# Altium schematic sheet LPDDR4 SDRAM-1.SchDoc
size A3; Date: 07.08.2025; CheckedBy: Own Check; CompanyName: No Company; DocumentNumber: ELK.PCB.0005.0005.A.A; Revision: V0.0.1; SheetNumber: 4; SheetTotal: 22
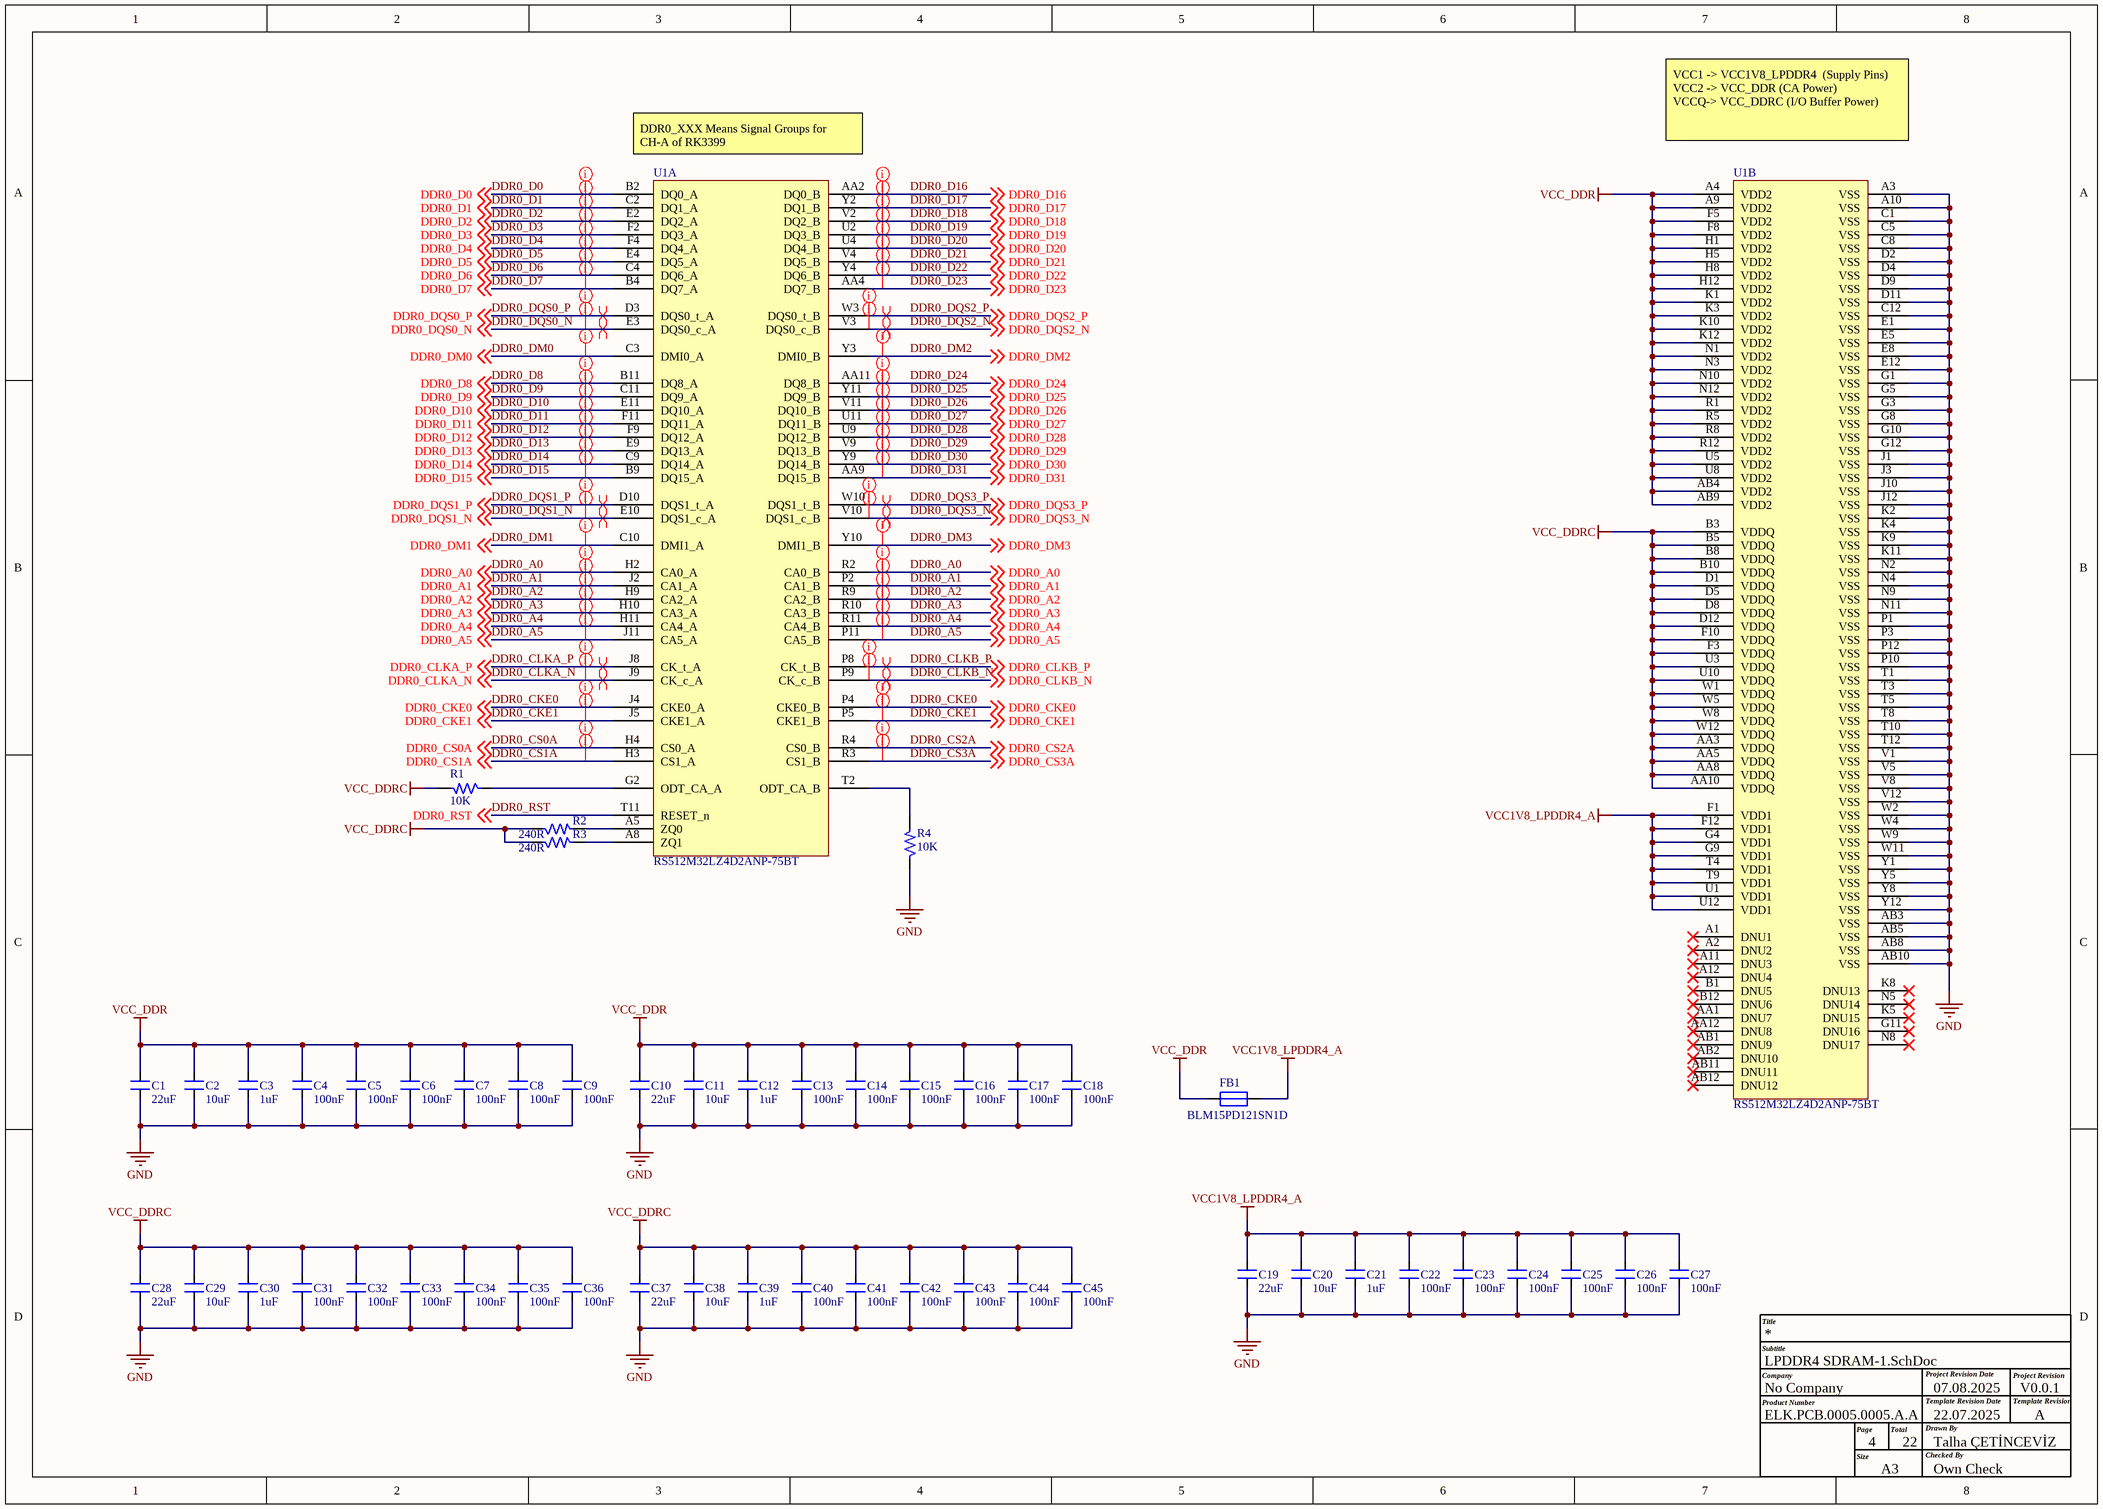
[diagram p0: LPDDR4 SDRAM-1.SchDoc]

## Parts
C1  22uF  [CAP_0402]
C2  10uF  [CAP_0402]
C3  1uF  [CAP_0201]
C4  100nF  [CAP_0201]
C5  100nF  [CAP_0201]
C6  100nF  [CAP_0201]
C7  100nF  [CAP_0201]
C8  100nF  [CAP_0201]
C9  100nF  [CAP_0201]
C10  22uF  [CAP_0402]
C11  10uF  [CAP_0402]
C12  1uF  [CAP_0201]
C13  100nF  [CAP_0201]
C14  100nF  [CAP_0201]
C15  100nF  [CAP_0201]
C16  100nF  [CAP_0201]
C17  100nF  [CAP_0201]
C18  100nF  [CAP_0201]
C19  22uF  [CAP_0402]
C20  10uF  [CAP_0402]
C21  1uF  [CAP_0201]
C22  100nF  [CAP_0201]
C23  100nF  [CAP_0201]
C24  100nF  [CAP_0201]
C25  100nF  [CAP_0201]
C26  100nF  [CAP_0201]
C27  100nF  [CAP_0201]
C28  22uF  [CAP_0402]
C29  10uF  [CAP_0402]
C30  1uF  [CAP_0201]
C31  100nF  [CAP_0201]
C32  100nF  [CAP_0201]
C33  100nF  [CAP_0201]
C34  100nF  [CAP_0201]
C35  100nF  [CAP_0201]
C36  100nF  [CAP_0201]
C37  22uF  [CAP_0402]
C38  10uF  [CAP_0402]
C39  1uF  [CAP_0201]
C40  100nF  [CAP_0201]
C41  100nF  [CAP_0201]
C42  100nF  [CAP_0201]
C43  100nF  [CAP_0201]
C44  100nF  [CAP_0201]
C45  100nF  [CAP_0201]
FB1  BLM15PD121SN1D  [RES_0402]
R1  10K  [RES_0201]
R2  240R  [RES_0201]
R3  240R  [RES_0201]
R4  10K  [RES_0201]
U1  RS512M32LZ4D2ANP-75BT  [FBGA200_SMD]  (parts A,B of 2)

## Nets
GND: C1.1 C2.1 C3.1 C4.1 C5.1 C6.1 C7.1 C8.1 C9.1 C10.1 C11.1 C12.1 C13.1 C14.1 C15.1 C16.1 C17.1 C18.1 C19.1 C20.1 C21.1 C22.1 C23.1 C24.1 C25.1 C26.1 C27.1 C28.1 C29.1 C30.1 C31.1 C32.1 C33.1 C34.1 C35.1 C36.1 C37.1 C38.1 C39.1 C40.1 C41.1 C42.1 C43.1 C44.1 C45.1 R4.1 U1.A3(VSS) U1.A10(VSS) U1.AB3(VSS) U1.AB5(VSS) U1.AB8(VSS) U1.AB10(VSS) U1.C1(VSS) U1.C5(VSS) U1.C8(VSS) U1.C12(VSS) U1.D2(VSS) U1.D4(VSS) U1.D9(VSS) U1.D11(VSS) U1.E1(VSS) U1.E5(VSS) U1.E8(VSS) U1.E12(VSS) U1.G1(VSS) U1.G3(VSS) U1.G5(VSS) U1.G8(VSS) U1.G10(VSS) U1.G12(VSS) U1.J1(VSS) U1.J3(VSS) U1.J10(VSS) U1.J12(VSS) U1.K2(VSS) U1.K4(VSS) U1.K9(VSS) U1.K11(VSS) U1.N2(VSS) U1.N4(VSS) U1.N9(VSS) U1.N11(VSS) U1.P1(VSS) U1.P3(VSS) U1.P10(VSS) U1.P12(VSS) U1.T1(VSS) U1.T3(VSS) U1.T5(VSS) U1.T8(VSS) U1.T10(VSS) U1.T12(VSS) U1.V1(VSS) U1.V5(VSS) U1.V8(VSS) U1.V12(VSS) U1.W2(VSS) U1.W4(VSS) U1.W9(VSS) U1.W11(VSS) U1.Y1(VSS) U1.Y5(VSS) U1.Y8(VSS) U1.Y12(VSS)
VCC1V8_LPDDR4_A: C19.2 C20.2 C21.2 C22.2 C23.2 C24.2 C25.2 C26.2 C27.2 FB1.1 U1.F1(VDD1) U1.F12(VDD1) U1.G4(VDD1) U1.G9(VDD1) U1.T4(VDD1) U1.T9(VDD1) U1.U1(VDD1) U1.U12(VDD1)
VCC_DDR: C1.2 C2.2 C3.2 C4.2 C5.2 C6.2 C7.2 C8.2 C9.2 C10.2 C11.2 C12.2 C13.2 C14.2 C15.2 C16.2 C17.2 C18.2 FB1.2 U1.A4(VDD2) U1.A9(VDD2) U1.AB4(VDD2) U1.AB9(VDD2) U1.F5(VDD2) U1.F8(VDD2) U1.H1(VDD2) U1.H5(VDD2) U1.H8(VDD2) U1.H12(VDD2) U1.K1(VDD2) U1.K3(VDD2) U1.K10(VDD2) U1.K12(VDD2) U1.N1(VDD2) U1.N3(VDD2) U1.N10(VDD2) U1.N12(VDD2) U1.R1(VDD2) U1.R5(VDD2) U1.R8(VDD2) U1.R12(VDD2) U1.U5(VDD2) U1.U8(VDD2)
VCC_DDRC: C28.2 C29.2 C30.2 C31.2 C32.2 C33.2 C34.2 C35.2 C36.2 C37.2 C38.2 C39.2 C40.2 C41.2 C42.2 C43.2 C44.2 C45.2 R1.2 R2.1 R3.1 U1.AA3(VDDQ) U1.AA5(VDDQ) U1.AA8(VDDQ) U1.AA10(VDDQ) U1.B3(VDDQ) U1.B5(VDDQ) U1.B8(VDDQ) U1.B10(VDDQ) U1.D1(VDDQ) U1.D5(VDDQ) U1.D8(VDDQ) U1.D12(VDDQ) U1.F3(VDDQ) U1.F10(VDDQ) U1.U3(VDDQ) U1.U10(VDDQ) U1.W1(VDDQ) U1.W5(VDDQ) U1.W8(VDDQ) U1.W12(VDDQ)
DDR0_A0: U1.H2(CA0_A) U1.R2(CA0_B) ; off-sheet DDR0_A0
DDR0_A1: U1.J2(CA1_A) U1.P2(CA1_B) ; off-sheet DDR0_A1
DDR0_A2: U1.H9(CA2_A) U1.R9(CA2_B) ; off-sheet DDR0_A2
DDR0_A3: U1.H10(CA3_A) U1.R10(CA3_B) ; off-sheet DDR0_A3
DDR0_A4: U1.H11(CA4_A) U1.R11(CA4_B) ; off-sheet DDR0_A4
DDR0_A5: U1.J11(CA5_A) U1.P11(CA5_B) ; off-sheet DDR0_A5
DDR0_CKE0: U1.J4(CKE0_A) U1.P4(CKE0_B) ; off-sheet DDR0_CKE0
DDR0_CKE1: U1.J5(CKE1_A) U1.P5(CKE1_B) ; off-sheet DDR0_CKE1
DDR0_CLKA_N: U1.J9(CK_c_A) ; off-sheet DDR0_CLKA_N
DDR0_CLKA_P: U1.J8(CK_t_A) ; off-sheet DDR0_CLKA_P
DDR0_CLKB_N: U1.P9(CK_c_B) ; off-sheet DDR0_CLKB_N
DDR0_CLKB_P: U1.P8(CK_t_B) ; off-sheet DDR0_CLKB_P
DDR0_CS0A: U1.H4(CS0_A) ; off-sheet DDR0_CS0A
DDR0_CS1A: U1.H3(CS1_A) ; off-sheet DDR0_CS1A
DDR0_CS2A: U1.R4(CS0_B) ; off-sheet DDR0_CS2A
DDR0_CS3A: U1.R3(CS1_B) ; off-sheet DDR0_CS3A
DDR0_D0: U1.B2(DQ0_A) ; off-sheet DDR0_D0
DDR0_D1: U1.C2(DQ1_A) ; off-sheet DDR0_D1
DDR0_D2: U1.E2(DQ2_A) ; off-sheet DDR0_D2
DDR0_D3: U1.F2(DQ3_A) ; off-sheet DDR0_D3
DDR0_D4: U1.F4(DQ4_A) ; off-sheet DDR0_D4
DDR0_D5: U1.E4(DQ5_A) ; off-sheet DDR0_D5
DDR0_D6: U1.C4(DQ6_A) ; off-sheet DDR0_D6
DDR0_D7: U1.B4(DQ7_A) ; off-sheet DDR0_D7
DDR0_D8: U1.B11(DQ8_A) ; off-sheet DDR0_D8
DDR0_D9: U1.C11(DQ9_A) ; off-sheet DDR0_D9
DDR0_D10: U1.E11(DQ10_A) ; off-sheet DDR0_D10
DDR0_D11: U1.F11(DQ11_A) ; off-sheet DDR0_D11
DDR0_D12: U1.F9(DQ12_A) ; off-sheet DDR0_D12
DDR0_D13: U1.E9(DQ13_A) ; off-sheet DDR0_D13
DDR0_D14: U1.C9(DQ14_A) ; off-sheet DDR0_D14
DDR0_D15: U1.B9(DQ15_A) ; off-sheet DDR0_D15
DDR0_D16: U1.AA2(DQ0_B) ; off-sheet DDR0_D16
DDR0_D17: U1.Y2(DQ1_B) ; off-sheet DDR0_D17
DDR0_D18: U1.V2(DQ2_B) ; off-sheet DDR0_D18
DDR0_D19: U1.U2(DQ3_B) ; off-sheet DDR0_D19
DDR0_D20: U1.U4(DQ4_B) ; off-sheet DDR0_D20
DDR0_D21: U1.V4(DQ5_B) ; off-sheet DDR0_D21
DDR0_D22: U1.Y4(DQ6_B) ; off-sheet DDR0_D22
DDR0_D23: U1.AA4(DQ7_B) ; off-sheet DDR0_D23
DDR0_D24: U1.AA11(DQ8_B) ; off-sheet DDR0_D24
DDR0_D25: U1.Y11(DQ9_B) ; off-sheet DDR0_D25
DDR0_D26: U1.V11(DQ10_B) ; off-sheet DDR0_D26
DDR0_D27: U1.U11(DQ11_B) ; off-sheet DDR0_D27
DDR0_D28: U1.U9(DQ12_B) ; off-sheet DDR0_D28
DDR0_D29: U1.V9(DQ13_B) ; off-sheet DDR0_D29
DDR0_D30: U1.Y9(DQ14_B) ; off-sheet DDR0_D30
DDR0_D31: U1.AA9(DQ15_B) ; off-sheet DDR0_D31
DDR0_DM0: U1.C3(DMI0_A) ; off-sheet DDR0_DM0
DDR0_DM1: U1.C10(DMI1_A) ; off-sheet DDR0_DM1
DDR0_DM2: U1.Y3(DMI0_B) ; off-sheet DDR0_DM2
DDR0_DM3: U1.Y10(DMI1_B) ; off-sheet DDR0_DM3
DDR0_DQS0_N: U1.E3(DQS0_c_A) ; off-sheet DDR0_DQS0_N
DDR0_DQS0_P: U1.D3(DQS0_t_A) ; off-sheet DDR0_DQS0_P
DDR0_DQS1_N: U1.E10(DQS1_c_A) ; off-sheet DDR0_DQS1_N
DDR0_DQS1_P: U1.D10(DQS1_t_A) ; off-sheet DDR0_DQS1_P
DDR0_DQS2_N: U1.V3(DQS0_c_B) ; off-sheet DDR0_DQS2_N
DDR0_DQS2_P: U1.W3(DQS0_t_B) ; off-sheet DDR0_DQS2_P
DDR0_DQS3_N: U1.V10(DQS1_c_B) ; off-sheet DDR0_DQS3_N
DDR0_DQS3_P: U1.W10(DQS1_t_B) ; off-sheet DDR0_DQS3_P
DDR0_RST: U1.T11(RESET_n) ; off-sheet DDR0_RST
NetR1_1: R1.1 U1.G2(ODT_CA_A)
NetR2_2: R2.2 U1.A5(ZQ0)
NetR3_2: R3.2 U1.A8(ZQ1)
NetR4_2: R4.2 U1.T2(ODT_CA_B)

Not connected (* = marked no-connect by the designer): U1 A1(DNU1)* A2(DNU2)* A11(DNU3)* A12(DNU4)* AA1(DNU7)* AA12(DNU8)* AB1(DNU9)* AB2(DNU10)* AB11(DNU11)* AB12(DNU12)* B1(DNU5)* B12(DNU6)* G11(DNU16)* K5(DNU15)* K8(DNU13)* N5(DNU14)* N8(DNU17)*

## Layout directives
differential pair; differential pair class DIFF100_DDR_DQS: DDR0_DQS0_N, DDR0_DQS0_P, DDR0_DQS1_N, DDR0_DQS1_P, DDR0_DQS2_N, DDR0_DQS2_P, DDR0_DQS3_N, DDR0_DQS3_P
differential pair; differential pair class DIFF100_DDR_CLK: DDR0_CLKA_N, DDR0_CLKA_P, DDR0_CLKB_N, DDR0_CLKB_P
net class 50OHM_DDR_D; net class DDR_G-1: DDR0_D0, DDR0_D1, DDR0_D2, DDR0_D3, DDR0_D4, DDR0_D5, DDR0_D6, DDR0_D7, DDR0_DM0
net class DIFF_PAIR_CLASS; net class DDR_G-1: DDR0_DQS0_N, DDR0_DQS0_P
net class 50OHM_DDR_D; net class DDR_G-2: DDR0_D8, DDR0_D9, DDR0_D10, DDR0_D11, DDR0_D12, DDR0_D13, DDR0_D14, DDR0_D15, DDR0_DM1
net class DIFF_PAIR_CLASS; net class DDR_G-2: DDR0_DQS1_N, DDR0_DQS1_P
net class 50OHM_DDR_A: DDR0_A0, DDR0_A1, DDR0_A2, DDR0_A3, DDR0_A4, DDR0_A5
net class DIFF_PAIR_CLASS: DDR0_CLKA_N, DDR0_CLKA_P, DDR0_CLKB_N, DDR0_CLKB_P
net class 50OHM_DDR_Ctrl: DDR0_CKE0, DDR0_CKE1, DDR0_CS0A, DDR0_CS1A, DDR0_CS2A, DDR0_CS3A
net class 50OHM_DDR_D; net class DDR_G-3: DDR0_D16, DDR0_D17, DDR0_D18, DDR0_D19, DDR0_D20, DDR0_D21, DDR0_D22, DDR0_D23, DDR0_DM2
net class DIFF_PAIR_CLASS; net class DDR_G-3: DDR0_DQS2_N, DDR0_DQS2_P
net class 50OHM_DDR_D; net class DDR_G-4: DDR0_D24, DDR0_D25, DDR0_D26, DDR0_D27, DDR0_D28, DDR0_D29, DDR0_D30, DDR0_D31, DDR0_DM3
net class DIFF_PAIR_CLASS; net class DDR_G-4: DDR0_DQS3_N, DDR0_DQS3_P
net class 50OHM_DDR_D: DDR0_A0, DDR0_A1, DDR0_A2, DDR0_A3, DDR0_A4, DDR0_A5

## Notes on the sheet
- (near U1) DDR0_XXX Means Signal Groups for CH-A of RK3399
- VCC1 -> VCC1V8_LPDDR4  (Supply Pins)
  VCC2 -> VCC_DDR (CA Power)
  VCCQ-> VCC_DDRC (I/O Buffer Power)
- Title
- Company
- Product Number
- Subtitle
- Project Revision Date
- Template Revision Date
- Project Revision
- Template Revision
- Size
- Page
- A3
- Total
- Checked By
- Drawn By
- 22.07.2025
- Talha ÇETİNCEVİZ
- A

## Library data of the parts
C1 C10 C19 C28 C37 = CAP_22uF-6.3V-20%-0402: 22µF ±20% 6.3V Ceramic Capacitor X5R 0402 (1005 Metric); Manufacturer: Murata Electronics; Manufacturer Part Number: CL05A226MQ5N6J8; Case/Package: 0402; Supplier-1: Digikey
C2 C11 C20 C29 C38 = CAP_10uF-10V-20%-0402: 10µF ±20% 10V Ceramic Capacitor X5R 0402 (1005 Metric); Manufacturer Part Number: CL05A106MP5NUNC; Manufacturer: Samsung Electro-Mechanics; Case/Package: 0402; Supplier-1: Digikey
C3 C12 C21 C30 C39 = CAP_1uF-16V-10%-0201: 1µF ±20% 16V Ceramic Capacitor X5R 0201 (0603 Metric); Manufacturer: Samsung Electro-Mechanics; Manufacturer Part Number: CL03A105MO3NRNH; Case/Package: 0201; Supplier-1: Digikey
C4-C9 C13-C18 C22-C27 C31-C36 C40-C45 = CAP_100nF-25V-10%-0201: 0.1µF ±10% 25V Ceramic Capacitor X5R 0201 (0603 Metric); Manufacturer: TDK Corporation; Manufacturer Part Number: C0603X5R1E104K030BB; Case/Package: 0201; Supplier-1: Digikey
FB1 = FB_120R-1.3A-100Mhz-0402: 120 Ohms @ 100MHz 1 Power Line Ferrite Bead 0402 (1005 Metric) 1.3A 90mOhm; Manufacturer: Murata Electronics; Mnaufacturer Part Number: BLM15PD121SN1D; Case/Package: 0402; Supplier-1: Digikey
R1 R4 = RES_10K-0.05W-1%-0201: 10 kOhms ±1% 0.05W, 1/20W Chip Resistor 0201 (0603 Metric) Thick Film; Manufacturer: Stackpole Electronics Inc; Manufacturer Part Number: RMCF0201FT10K0; Case/Package: 0201; Supplier-1: Digikey
R2 R3 = RES_240R-0.05W-1%-0201: 240 Ohms ±1% 0.05W, 1/20W Chip Resistor 0201 (0603 Metric) Thick Film; Manufacturer: Yageo; Manufacturer Part Number: RC0201FR-07240RL; Case/Package: 0201; Supplier-1: Digikey
U1 = IC_RS512M32LZ4D2ANP-75BT: LPDDR4/4X Package FBGA 200b Density 4Gbit~64Gbit Operating Temperature Range：-25~85℃ Speed：2667Mbps/3200Mbps/3733Mbps Voltage：VDD1/VDD2/VDDQ= 1.8 / 1.1 / 1.1 V（LPDDR4）VDD1/VDD2/VDDQ = 1.8 / 1.1 / 0.6 V（LPDDR4X）Approved Verification Platform：MTK、Spreadtrum; Manufacturer: RAYSON; Manufacturer Part Number: RS512M32LZ4D2ANP-75BT; Case/Package: FBGA 200b; Supplier-1: RAYSON